# EAGLE design Callisto_MSO_Teknic (EAGLE 9.6.2)
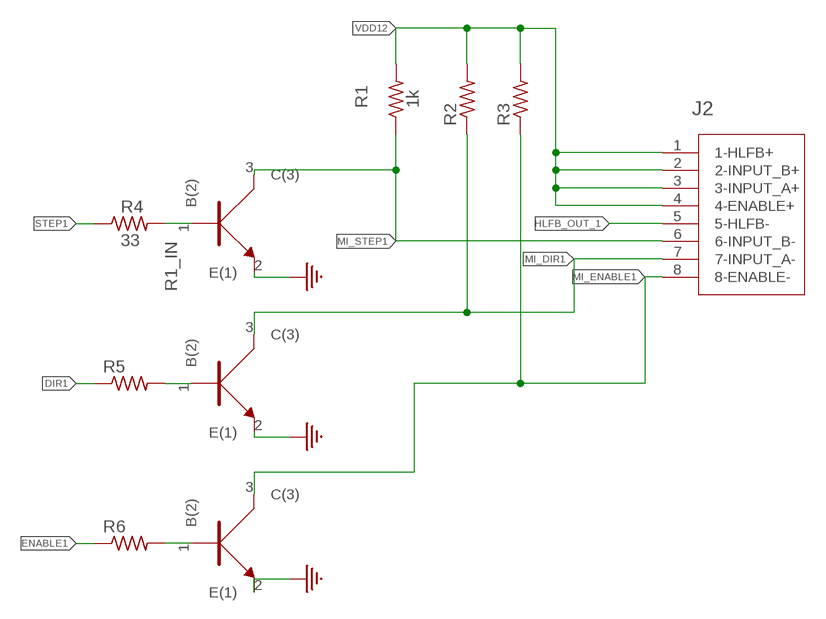
[diagram p0: schematic, sheet 1]

## Parts
J2  TEKNIC_8PIN_MOTOR  [CON_39281083]
R1  1k  R_0805  [0805]
R2  R_0805  [0805]
R3  R_0805  [0805]
R4  33  R_0805  [0805]
R5  R_0805  [0805]
R6  R_0805  [0805]
U1  NPN  BC846BW  [SOT323]
U2  NPN  BC846BW  [SOT323]
U3  NPN  BC846BW  [SOT323]

## Nets
DIR1: R5.1
ENABLE1: R6.1
GND: U1.2(E(1)) U2.2(E(1)) U3.2(E(1))
HLFB_OUT_1: J2.5(5-HLFB-)
MI_DIR1: J2.7(7-INPUT_A-) R2.1 U2.3(C(3))
MI_ENABLE1: J2.8(8-ENABLE-) R3.1 U3.3(C(3))
MI_STEP1: J2.6(6-INPUT_B-) R1.1 U1.3(C(3))
N$2: R5.2 U2.1(B(2))
N$3: R6.2 U3.1(B(2))
R1_IN: R4.2 U1.1(B(2))
STEP1: R4.1
VDD12: J2.1(1-HLFB+) J2.2(2-INPUT_B+) J2.3(3-INPUT_A+) J2.4(4-ENABLE+) R1.2 R2.2 R3.2

## Library data of the parts
J2 = 3D_MIG_Controller:TEKNIC_8PIN_MOTOR; COPYRIGHT: Copyright (C) 2022 Ultra Librarian. All rights reserved.; MANUFACTURER_PART_NUMBER: 39281083; MFR_NAME: Molex Connector Corporation
R1-R6 = 3D_MIG_Controller:R_0805
U1-U3 = 3D_MIG_Controller:BC846BW: Bipolar (BJT) Transistor NPN 100MHz Surface Mount SOT-323; PARTNO: BC846BW_NPN

## Board
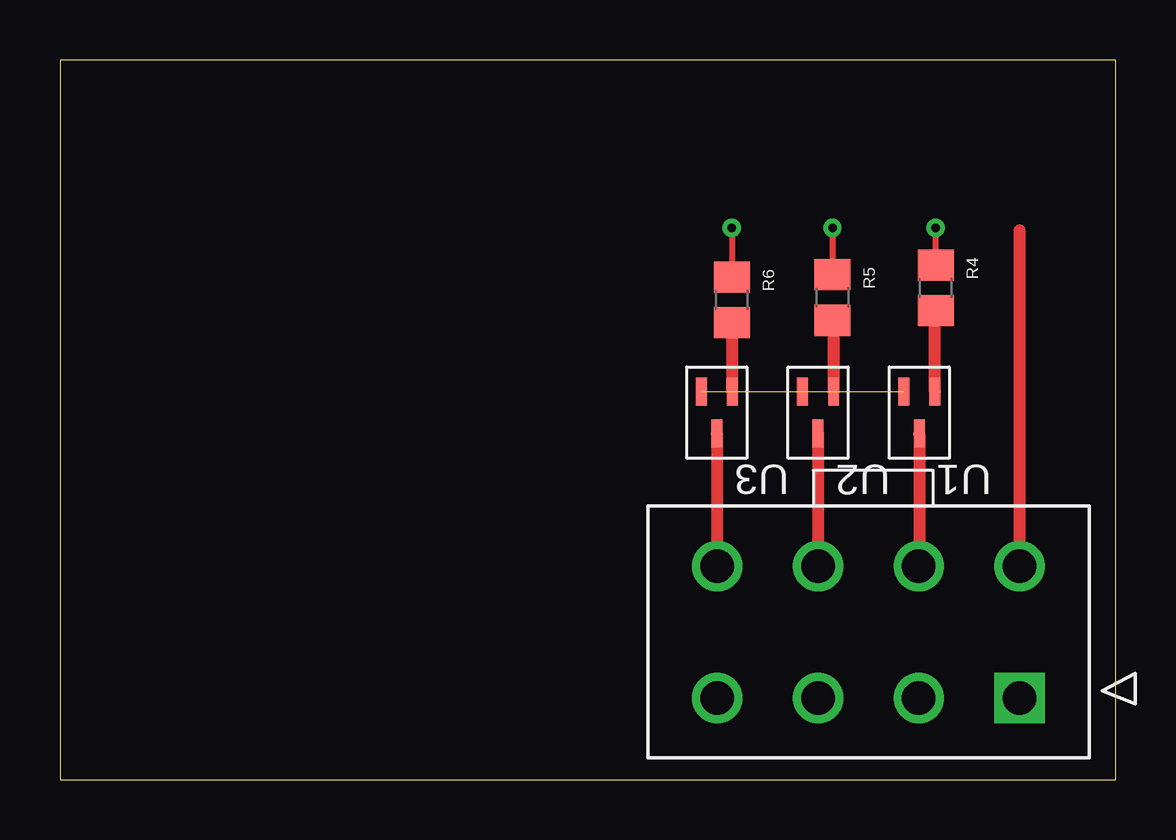
[diagram p1: board, top side]
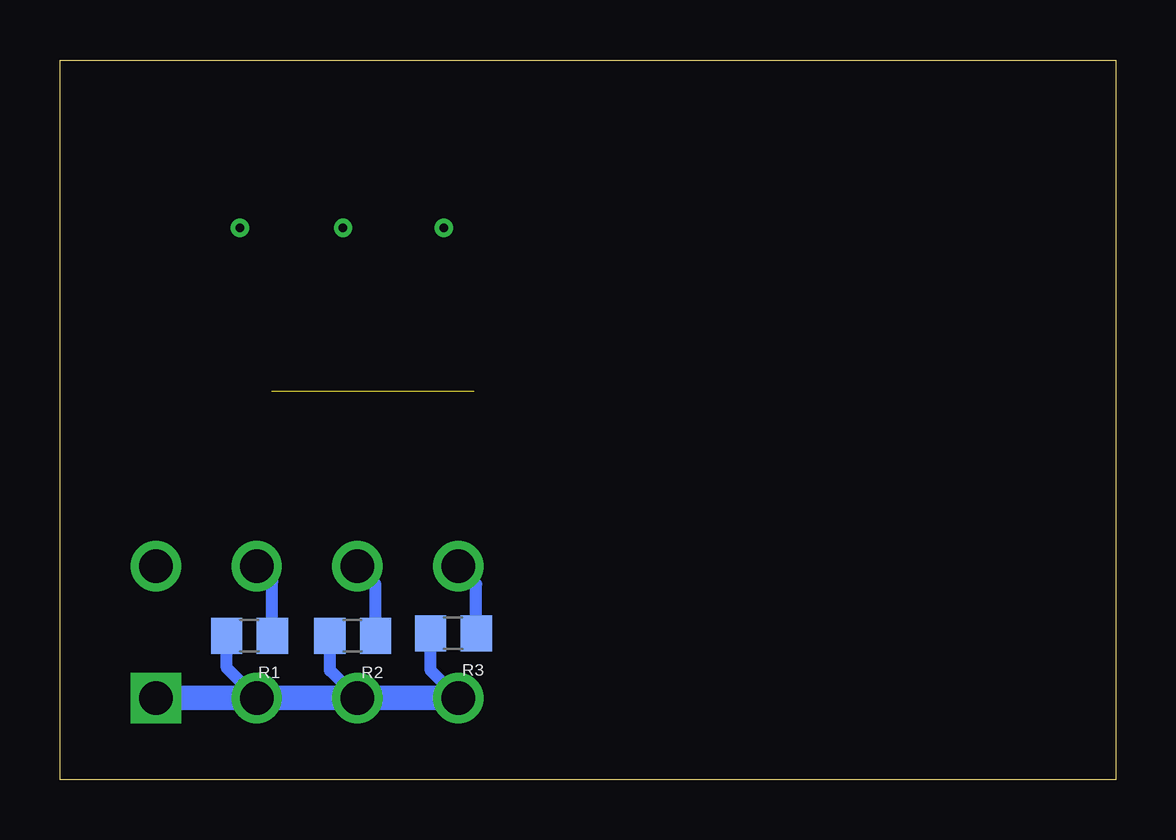
[diagram p2: board, bottom side, seen from below]

Size 44 x 30 mm. Coordinates in mm from the lower left corner, seen from the top.
Outline: 0,0 44,0 44,30 0,30 0,0
Copper layers (1*16): Top 0.035mm / dielectric 1.5mm / Bottom 0.035mm
Design rules "default": minimum track width 6mil, minimum drill 0.35mm, track to track 6mil, track to pad 6mil, pad to pad 6mil, via to via 6mil, smd to smd 6mil, copper to edge 40mil, drill to drill 6mil, minimum pad ring 10mil, minimum via ring 8mil, stop-mask expansion 4mil, vias tented up to drill 0mil, thermal gap 10mil

### Footprints (pad centres in the part's own frame; a part is rotated, then mirrored left to right if it is on the bottom)
CON_39281083 = drill 1.397 pad 1.905 square: 1 12.6,-5.5 | drill 1.397 pad 1.905: 2 8.4,-5.5; 3 4.2,-5.5; 4 0,-5.5; 5 12.6,0; 6 8.4,0; 7 4.2,0; 8 0,0
0805 = smd 1.3 x 1.5: 1 -0.95,0; 2 0.95,0
SOT323 = smd 0.457 x 1.168: 1 -0.65,-0.876; 2 0.65,-0.876; 3 0,0.876

### Placement (x,y rotation side)
J2  27.4,8.9 0 top
R1  36.1,6 180 bottom
R2  31.8,6 180 bottom
R3  27.6,6.1 180 bottom
R4  36.5,20.5 270 top
R5  32.2,20.1 270 top
R6  28,20 270 top
U1  35.82,15.3 180 top
U2  31.6,15.3 180 top
U3  27.38,15.3 180 top

### Tracks (layer width: path | path; a pad name or v marks a point on that pad's centre or on a via)
DIR1  (via drill 0.35)
  Top 0.254: v32.2,23 R5.1
ENABLE1  (via drill 0.35)
  Top 0.254: v28,23 R6.1
GND  (2 unrouted)
HLFB_OUT_1
  Top 0.508: J2.5 40,22.9
MI_DIR1
  Top 0.508: U2.3 J2.7
  Bottom 0.508: R2.1 30.85,8.15 J2.7
MI_ENABLE1
  Top 0.508: U3.3 27.38,8.92 J2.8
  Bottom 0.508: R3.1 26.65,8.15 J2.8
MI_STEP1
  Top 0.254: 35.82,8.92 J2.6
  Top 0.508: U1.3 35.82,8.92
  Bottom 0.508: R1.1 35.15,8.25 J2.6
N$2
  Top 0.254: 32.25,19.1 R5.2
  Top 0.508: U2.1 32.25,19.1
N$3
  Top 0.508: U3.1 28.03,19.02 R6.2
R1_IN
  Top 0.508: U1.1 36.47,19.52 R4.2
STEP1  (via drill 0.35)
  Top 0.254: R4.1 v36.5,23
VDD12
  Bottom 0.508: J2.4 28.55,4.55 R3.2 | J2.3 32.75,4.55 R2.2 | J2.2 37.05,4.65 R1.2
  Bottom 1.016: J2.1 J2.2 J2.3 J2.4